# Altium schematic sheet LED_DRV.SchDoc
size A4
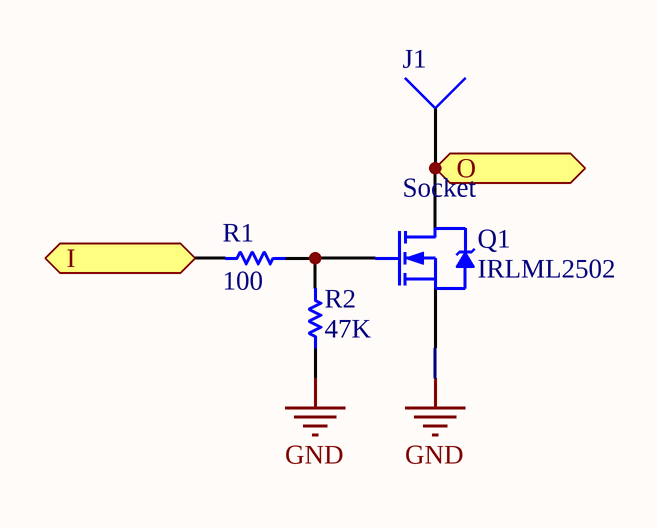
[diagram p0: LED_DRV.SchDoc]

## Parts
J1  Socket  [PIN#001]
Q1  IRLML2502  [SOT-23_N]
R1  value 100  [0603x]
R2  value 47K  [0603x]

## Ports
I, O

## Nets
GND: Q1.2(S) R2.1
I: R1.2 ; port I
O: J1.1 Q1.3(D) ; port O
NetQ1_1: Q1.1(G) R1.1 R2.2

## Library data of the parts
Q1 = IRLML2402: HEXFET Power MOSFET; Published: 8-Jun-2000; LatestRevisionDate: 20-Nov-2009; LatestRevisionNote: IPC-7351 Footprint Added.; DatasheetVersion: Aug-1997; PackageReference: SOT-23; Publisher: Altium Limited; PackageDescription: 3-Pin SOT-23 Package 0.95 mm Pitch, 2.3 mm Lead Span; ComponentLink1Description: Manufacturer Link; ComponentLink1URL: http://www.irf.com/; ComponentLink2Description: Datasheet; ComponentLink2URL: http://www.irf.com/product-info/datasheets/data/irlml2402.pdf
R1 R2 = Res1: Resistor; Published: 8-Jun-2000; LatestRevisionDate: 17-Jul-2002; LatestRevisionNote: Re-released for DXP Platform.; PackageReference: AXIAL-0.3; Publisher: Altium Limited; PackageDescription: Axial Device, Thru-Hole; 2 Leads; 0.3 in Pin Spacing
J1 = Socket: LatestRevisionDate: 17-Jul-2002; LatestRevisionNote: Re-released for DXP Platform.; Publisher: Altium Limited